# EAGLE design PCB_sch (EAGLE 9.6.2)
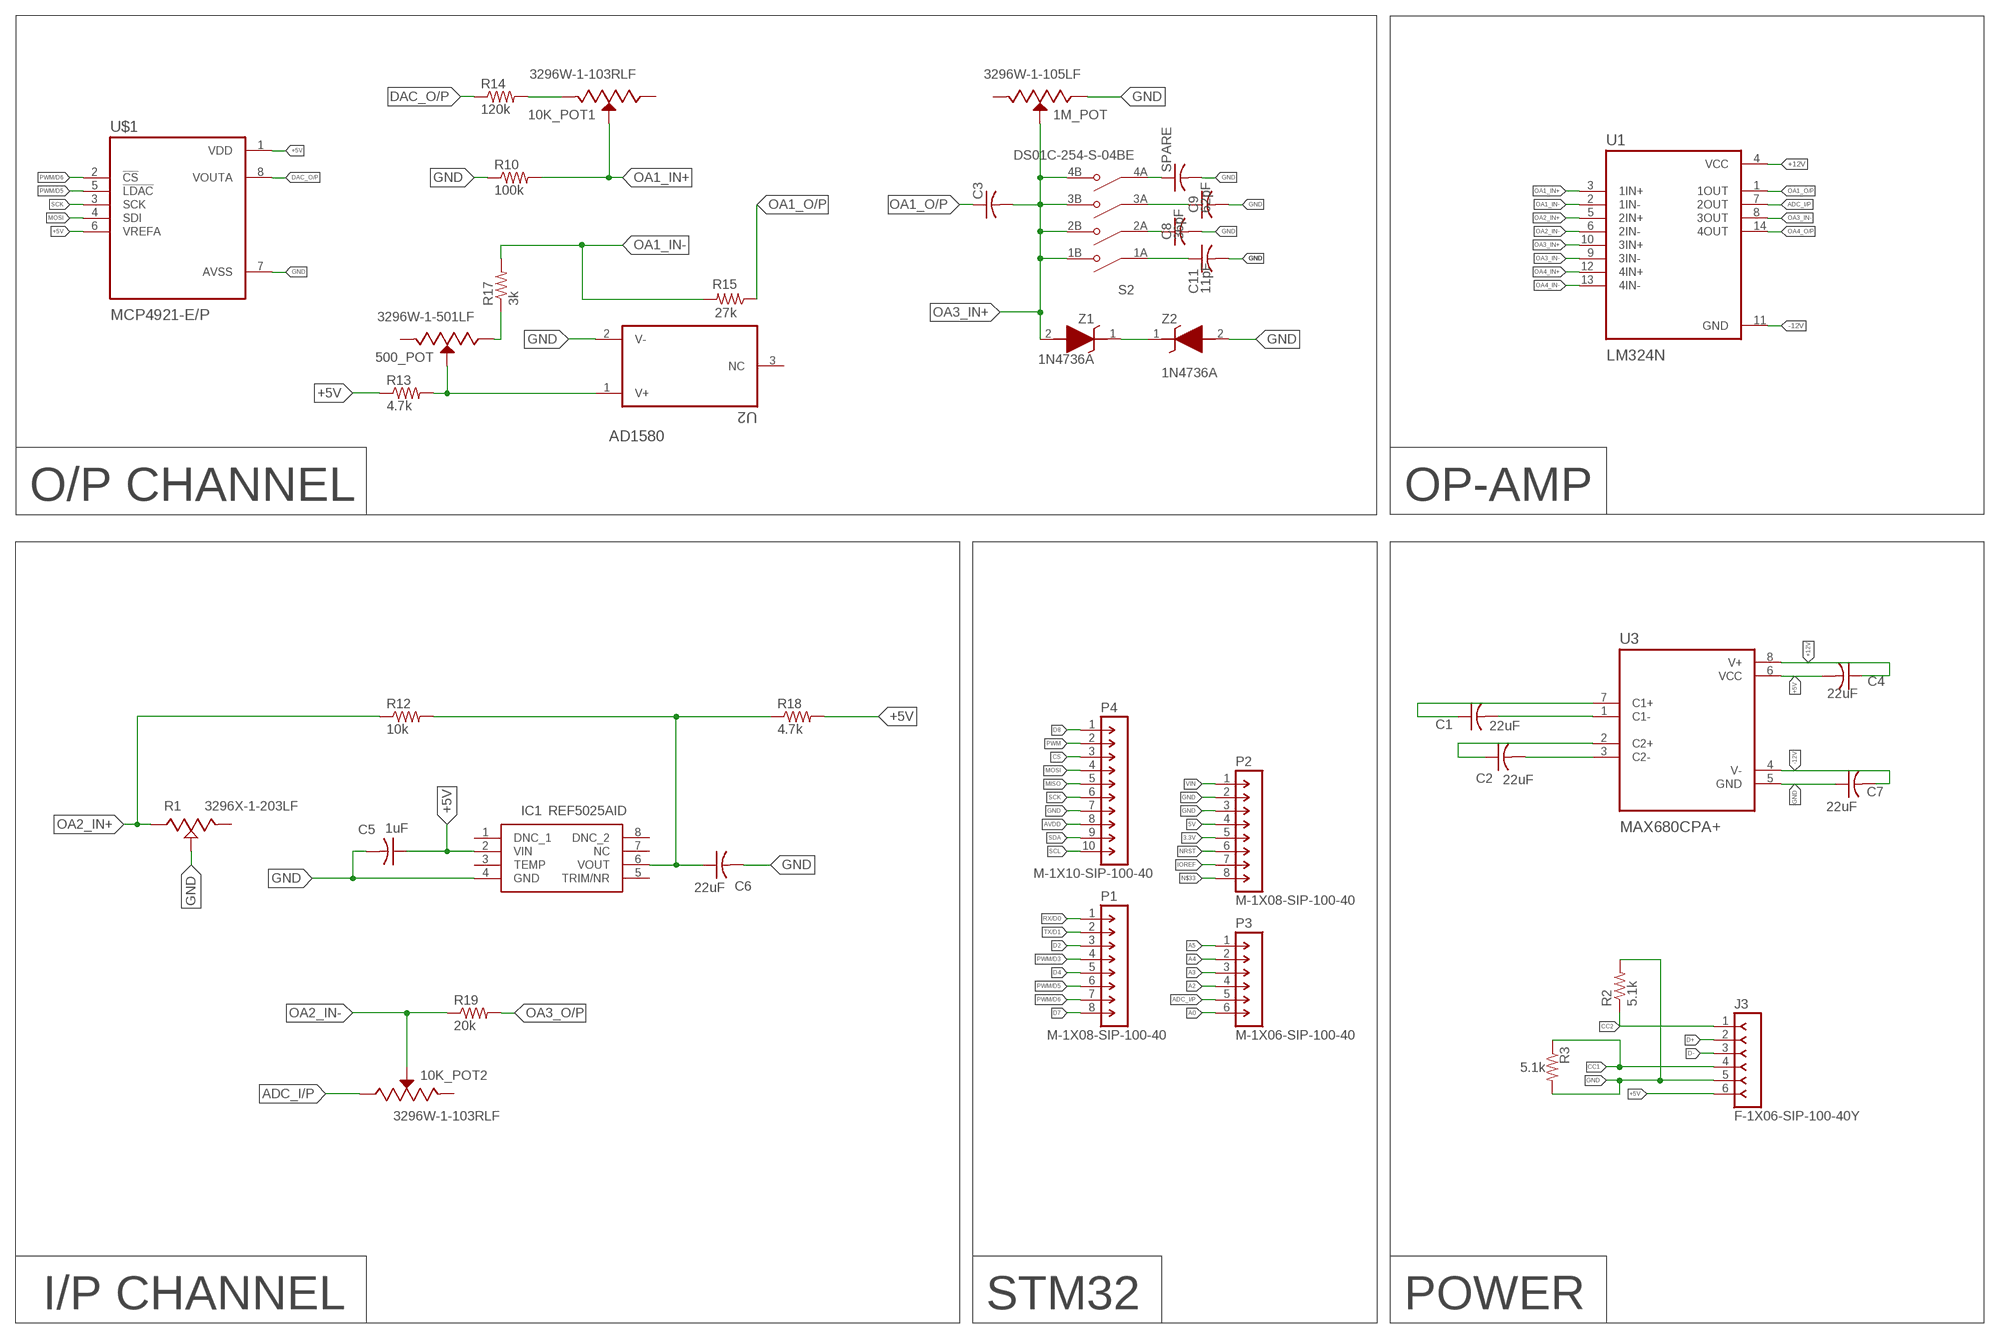
[diagram p0: schematic, sheet 1]

## Parts
1M_POT  3296W-1-105LF  [TRIM_3296W-1-105LF]
10K_POT1  3296W-1-103RLF  [TRIM_3296W-1-103RLF]
10K_POT2  3296W-1-103RLF  [TRIM_3296W-1-103RLF]
500_POT  3296W-1-501LF  [TRIM_3296W-1-501LF]
C1  22uF  C-USC0805  [C0805]
C2  22uF  C-USC0805  [C0805]
C3  C-US050-030X075  [C050-030X075]
C4  22uF  C-USC0805  [C0805]
C5  1uF  C-USC0805K  [C0805K]
C6  22uF  C-USC0805K  [C0805K]
C7  22uF  C-USC0805  [C0805]
C8  36pF  C-USC0805  [C0805]
C9  62pF  C-USC0805  [C0805]
C11  11pF  C-USC0805  [C0805]
IC1  REF5025AID  [SOIC127P600X175-8N]
J3  F-1X06-SIP-100-40Y  [SIP-100-06-40Y]
P1  M-1X08-SIP-100-40  [SIP-100-08-40]
P2  M-1X08-SIP-100-40  [SIP-100-08-40]
P3  M-1X06-SIP-100-40  [SIP-100-06-40]
P4  M-1X10-SIP-100-40  [SIP-100-10-40]
R1  3296X-1-203LF  [TRIM_3296X-1-203LF]
R2  5.1k  R-US_R0805  [R0805]
R3  5.1k  R-US_R0805  [R0805]
R10  100k  R-US_M0805  [M0805]
R12  10k  R-US_M0805  [M0805]
R13  4.7k  R-US_M0805  [M0805]
R14  120k  R-US_M0805  [M0805]
R15  27k  R-US_M0805  [M0805]
R17  3k  R-US_M0805  [M0805]
R18  4.7k  R-US_M0805  [M0805]
R19  20k  R-US_M0805  [M0805]
S2  DS01C-254-S-04BE  [SW_DS01C-254-S-04BE]
SPARE  C-USC0805  [C0805]
U1  LM324N  [DIP794W45P254L1969H508Q14]
U2  AD1580  AD1580BRTZ-R2-REEL7  [SOT96P237X112-3N]
U3  MAX680CPA+  [DIP794W47P254L991H457Q8]
U$1  MCP4921-E/P  [DIP787W46P254L927H533Q8]
Z1  1N4736A  [DIOAD1413W86L463D238]
Z2  1N4736A  [DIOAD1413W86L463D238]

## Nets
3.3V: P2.5
5V: P2.4
+5V: C4.2 C5.1 IC1.2(VIN) J3.6 R13.1 R18.2 U3.6(VCC) U$1.1(VDD) U$1.6(VREFA)
+12V: C4.1 U1.4(VCC) U3.8(V+)
-12V: C7.2 U1.11(GND) U3.4(V-)
A0: P3.6
A2: P3.4
A3: P3.3
A4: P3.2
A5: P3.1
ADC_I/P: 10K_POT2.1(CCW) P3.5 U1.7(2OUT)
AVDD: P4.8
CC1: J3.4 R3.1
CC2: J3.1 R2.1
CS: P4.3
D2: P1.3
D4: P1.5
D7: P1.8
D8: P4.1
D+: J3.2
D-: J3.3
DAC_O/P: R14.1 U$1.8(VOUTA)
GND: 1M_POT.1(CCW) C5.2 C6.2 C7.1 C8.2 C9.2 C11.2 IC1.4(GND) J3.5 P2.2 P2.3 P4.7 R1.2(WIPER) R2.2 R3.2 R10.1 SPARE.2 U2.2(V-) U3.5(GND) U$1.7(AVSS) Z2.2(A)
IOREF: P2.7
MISO: P4.5
MOSI: P4.4 U$1.4(SDI)
N$1: 10K_POT1.3(CW) R14.2
N$2: 10K_POT1.2(WIPER) R10.2
N$3: R15.2 R17.2
N$4: 500_POT.1(CCW) R17.1
N$5: C1.2 U3.1(C1-)
N$6: 500_POT.2(WIPER) R13.2 U2.1(V+)
N$7: C6.1 IC1.6(VOUT) R12.2 R18.1
N$8: Z1.1(K) Z2.1(K)
N$9: C1.1 U3.7(C1+)
N$10: C2.2 U3.3(C2-)
N$11: C2.1 U3.2(C2+)
N$12: C9.1 S2.3A(COM3)
N$13: S2.4A(COM4) SPARE.1
N$14: C11.1 S2.1A(COM1)
N$15: C8.1 S2.2A(COM2)
N$33: P2.8
NRST: P2.6
OA1_IN+: U1.3(1IN+)
OA1_IN-: U1.2(1IN-)
OA1_O/P: C3.1 R15.1 U1.1(1OUT)
OA2_IN+: R1.1(CCW) R12.1 U1.5(2IN+)
OA2_IN-: 10K_POT2.2(WIPER) R19.1 U1.6(2IN-)
OA3_IN+: 1M_POT.2(WIPER) C3.2 S2.1B(NO1) S2.2B(NO2) S2.3B(NO3) S2.4B(NO4) U1.10(3IN+) Z1.2(A)
OA3_IN-: U1.8(3OUT) U1.9(3IN-)
OA3_O/P: R19.2
OA4_IN+: U1.12(4IN+)
OA4_IN-: U1.13(4IN-)
OA4_O/P: U1.14(4OUT)
PWM: P4.2
PWM/D3: P1.4
PWM/D5: P1.6 U$1.5(!LDAC)
PWM/D6: P1.7 U$1.2(!CS)
RX/D0: P1.1
SCK: P4.6 U$1.3(SCK)
SCL: P4.10
SDA: P4.9
TX/D1: P1.2
VIN: P2.1
Unconnected: 1M_POT.3(CW) 10K_POT1.1(CCW) 10K_POT2.3(CW) 500_POT.3(CW) IC1.1(DNC_1) IC1.3(TEMP) IC1.5(TRIM/NR) IC1.7(NC) IC1.8(DNC_2) R1.3(CW) U2.3(NC)

## Notes on the sheet
- O/P CHANNEL | OP-AMP
- I/P CHANNEL | STM32 | POWER

## Library data of the parts
1M_POT = 3296W-1-105LF:3296W-1-105LF: Res Cermet Trimmer 500K Ohm 10% 0.5W 25(Elec)Turn 2.19mm (9.53 X 4.83 X 11.55mm) Pin Thru-Hole Tube Check availability <https://pricing.snapeda.com/parts/3296W-1-105LF/Bourns/view-part?ref=eda>; AVAILABILITY: In Stock; CHECK_PRICES: https://www.snapeda.com/parts/3296W-1-105LF/Bourns/view-part/?ref=eda; DESCRIPTION: Trimmer, Cermet, Rest 1 Megohms, PCB, 25 Turns, Pwr-Rtg 0.5W | Bourns 3296W-1-105LF; MF: Bourns; MP: 3296W-1-105LF; PACKAGE: NON STANDARD-3 Bourns; PRICE: None; SNAPEDA_LINK: https://www.snapeda.com/parts/3296W-1-105LF/Bourns/view-part/?ref=snap
10K_POT1 10K_POT2 = 3296W-1-103RLF:3296W-1-103RLF: Res Cermet Trimmer 500K Ohm 10% 0.5W 25(Elec)Turn 2.19mm (9.53 X 4.83 X 11.55mm) Pin Thru-Hole Tube Check availability <https://pricing.snapeda.com/parts/3296W-1-103RLF/Bourns/view-part?ref=eda>; AVAILABILITY: In Stock; CHECK_PRICES: https://www.snapeda.com/parts/3296W-1-103RLF/Bourns/view-part/?ref=eda; DESCRIPTION: Trimmer, Cermet, Rest 10 Kilohms, PCB, 25 Turns, Pwr-Rtg 0.5W | Bourns 3296W-1-103RLF; MF: Bourns; MP: 3296W-1-103RLF; PACKAGE: NON STANDARD-3 Bourns; PRICE: None; PURCHASE-URL: https://www.snapeda.com/api/url_track_click_mouser/?unipart_id=480309&manufacturer=Bourns&part_name=3296W-1-103RLF&search_term=None; SNAPEDA_LINK: https://www.snapeda.com/parts/3296W-1-103RLF/Bourns/view-part/?ref=snap
500_POT = 3296W-1-501LF:3296W-1-501LF: Res Cermet Trimmer 500K Ohm 10% 0.5W 25(Elec)Turn 2.19mm (9.53 X 4.83 X 11.55mm) Pin Thru-Hole Tube Check availability <https://pricing.snapeda.com/parts/3296W-1-501LF/Bourns/view-part?ref=eda>; AVAILABILITY: In Stock; CHECK_PRICES: https://www.snapeda.com/parts/3296W-1-501LF/Bourns/view-part/?ref=eda; DESCRIPTION: Trimmer, Cermet, Rest 500 Ohms, PCB, 25 Turns, Pwr-Rtg 0.5W | Bourns 3296W-1-501LF; MF: Bourns; MP: 3296W-1-501LF; PACKAGE: NON STANDARD-3 Bourns; PRICE: None; SNAPEDA_LINK: https://www.snapeda.com/parts/3296W-1-501LF/Bourns/view-part/?ref=snap
C1-C9 SPARE = adafruit:C-US: CAPACITOR, American symbol
C11 = adafruit:C-US: CAPACITOR, American symbol; SPICEPREFIX: C
IC1 = REF5025AID:REF5025AID: 3 Vpp/V Noise, 3 ppm/C Drift Precision Series Voltage Reference Source: Datasheet <http://www.ti.com/lit/ds/symlink/ref5025.pdf>; DESCRIPTION: 3 Vpp/V Noise, 3 ppm/C Drift Precision Series Voltage Reference; HEIGHT: 1.75mm; MANUFACTURER_NAME: Texas Instruments; MANUFACTURER_PART_NUMBER: REF5025AID; MOUSER_PART_NUMBER: 595-REF5025AID; MOUSER_PRICE-STOCK: https://www.mouser.co.uk/ProductDetail/Texas-Instruments/REF5025AID?qs=xL7PkI2RoJ6OzMm6G7%2FePw%3D%3D
J3 = con-headers-jp:F-1X06-: FEMALE HEADER
P1 P2 = con-headers-jp:M-1X08-: MALE HEADER
P3 = con-headers-jp:M-1X06-: MALE HEADER
P4 = con-headers-jp:M-1X10-: MALE HEADER
R1 = 3296X-1-203LF:3296X-1-203LF: Res Cermet Trimmer 20K Ohm 10% 1/2W 25(Elec)Turn 2.19mm (11.05 X 4.83 X 10.03mm) Pin Thru-Hole Tube Check availability <https://pricing.snapeda.com/parts/3296X-1-203LF/Bourns/view-part?ref=eda>; AVAILABILITY: In Stock; CHECK_PRICES: https://www.snapeda.com/parts/3296X-1-203LF/Bourns/view-part/?ref=eda; DESCRIPTION: Trimmer, Cermet, Rest 20 Kilohms, PCB, 25 Turns, Pwr-Rtg 0.5W | Bourns 3296X-1-203LF; MF: Bourns; MP: 3296X-1-203LF; PACKAGE: SOD-123 Bourns; PRICE: None; PURCHASE-URL: https://www.snapeda.com/api/url_track_click_mouser/?unipart_id=270465&manufacturer=Bourns&part_name=3296X-1-203LF&search_term=None; SNAPEDA_LINK: https://www.snapeda.com/parts/3296X-1-203LF/Bourns/view-part/?ref=snap
R2 R3 R10 R12-R15 R17-R19 = adafruit:R-US_: RESISTOR, American symbol
S2 = DS01C-254-S-04BE:DS01C-254-S-04BE; MANUFACTURER: CUI; MAXIMUM_PACKAGE_HEIGHT: 7.0mm; PARTREV: 1.0; STANDARD: Manufacturer recommendations
U1 = LM324N:LM324N: Check availability <https://pricing.snapeda.com/parts/LM324N/STMicroelectronics/view-part?ref=eda>; AVAILABILITY: In Stock; CHECK_PRICES: https://www.snapeda.com/parts/LM324N/STMicroelectronics/view-part/?ref=eda; DESCRIPTION: Operational amplifier; 3÷32VDC; Channels: 4; DIP14; MF: STMicroelectronics; MP: LM324N; PACKAGE: DIP-14 Motorola; PRICE: None; PURCHASE-URL: https://www.snapeda.com/api/url_track_click_mouser/?unipart_id=18365&manufacturer=STMicroelectronics&part_name=LM324N&search_term=None; SNAPEDA_LINK: https://www.snapeda.com/parts/LM324N/STMicroelectronics/view-part/?ref=snap
U2 = AD1580BRTZ-R2-REEL7:AD1580BRTZ-R2-REEL7
U3 = MAX680CPA_:MAX680CPA+: None Check availability <https://pricing.snapeda.com/parts/MAX680CPA%2B/Maxim%20Integrated%20Products/view-part?ref=eda>; AVAILABILITY: In Stock; CHECK_PRICES: https://www.snapeda.com/parts/MAX680CPA+/Analog+Devices/view-part/?ref=eda; DESCRIPTION: Charge Pump Switching Regulator IC Positive and Negative (Dual Rail) Fixed ±2Vin 2 Output 10mA 8-DIP (0.300, 7.62mm); MF: Maxim Integrated Products; MP: MAX680CPA+; PACKAGE: None; PRICE: None; SNAPEDA_LINK: https://www.snapeda.com/parts/MAX680CPA+/Analog+Devices/view-part/?ref=snap
U$1 = MCP4921-E_P:MCP4921-E/P; CHECK_PRICES: https://www.snapeda.com/parts/MCP4921-E/P/Microchip/view-part/?ref=eda; DESCRIPTION: Microchip 12 bit Serial DAC 8-Pin PDIP | Microchip Technology Inc. MCP4921-E/P; MF: Microchip; MP: MCP4921-E/P; PACKAGE: DIP-8 Microchip; PURCHASE-URL: https://www.snapeda.com/api/url_track_click_mouser/?unipart_id=60&manufacturer=Microchip&part_name=MCP4921-E/P&search_term=mcp4921; SNAPEDA_LINK: https://www.snapeda.com/parts/MCP4921-E/P/Microchip/view-part/?ref=snap
Z1 Z2 = 1N4736A:1N4736A: 1N4736 - Zener Diode, 6.8V, 5%, 1W Source: Datasheet <https://www.onsemi.com/pdf/datasheet/1n4736at-d.pdf>; DESCRIPTION: 1N4736 - Zener Diode, 6.8V, 5%, 1W; HEIGHT: mm; MANUFACTURER_NAME: onsemi; MANUFACTURER_PART_NUMBER: 1N4736A; MOUSER_PART_NUMBER: 512-1N4736A; MOUSER_PRICE-STOCK: https://www.mouser.co.uk/ProductDetail/onsemi-Fairchild/1N4736A?qs=SSucg2PyLi6CNqBOqJ%2FVZw%3D%3D

## Board
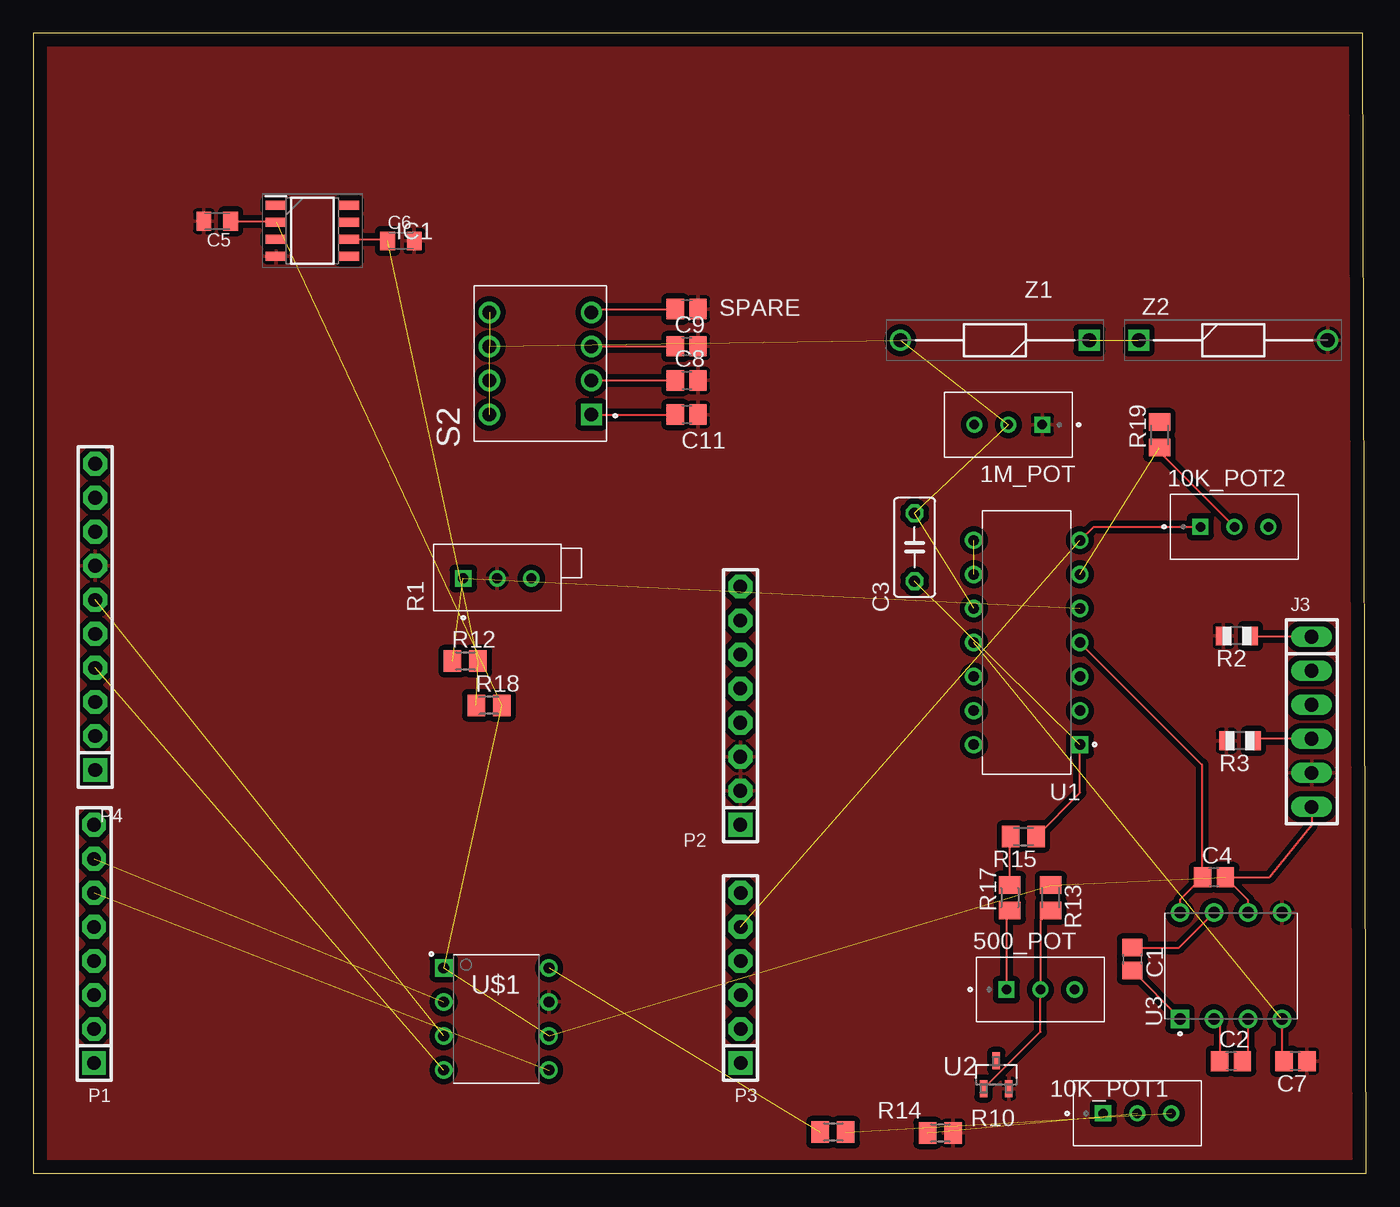
[diagram p1: board, top side]
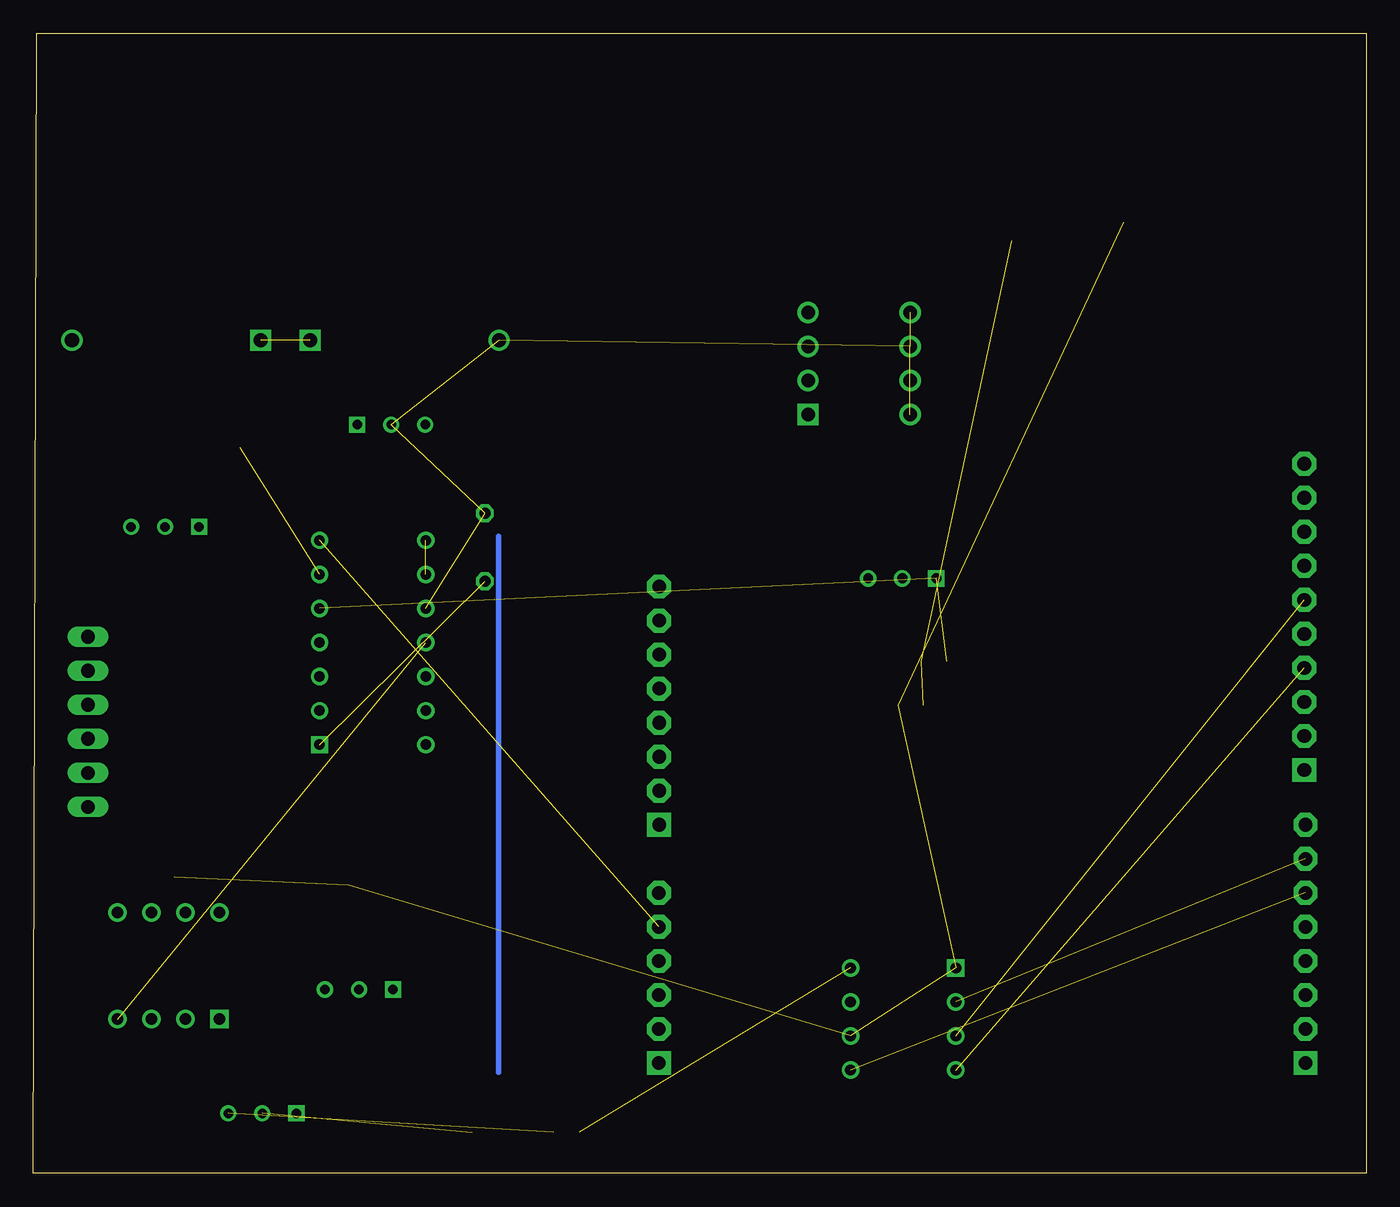
[diagram p2: board, bottom side, seen from below]

Size 99.49 x 85.08 mm. Coordinates in mm from the lower left corner, seen from the top.
Outline: 0,0 99.49,0 99.24,85.08 0,85.08 0,0
Copper layers (1*16): Top 0.035mm / dielectric 1.5mm / Bottom 0.035mm
Design rules "default *": minimum track width 6mil, minimum drill 0.35mm, track to track 16mil, track to pad 16mil, pad to pad 16mil, via to via 16mil, smd to smd 16mil, copper to edge 40mil, drill to drill 6mil, minimum pad ring 10mil, minimum via ring 8mil, stop-mask expansion 4mil, vias tented up to drill 0mil, thermal gap 10mil

### Footprints (pad centres in the part's own frame; a part is rotated, then mirrored left to right if it is on the bottom)
TRIM_3296W-1-105LF = drill 0.71 square: 1 -2.54,0 | drill 0.71: 2 0,0; 3 2.54,0
TRIM_3296W-1-103RLF = drill 0.71 square: 1 -2.54,0 | drill 0.71: 2 0,0; 3 2.54,0
TRIM_3296W-1-501LF = drill 0.71 square: 1 -2.54,0 | drill 0.71: 2 0,0; 3 2.54,0
C0805 = smd 1.3 x 1.5: 1 -0.85,0; 2 0.85,0
C050-030X075 = drill 0.813 octagon: 1 -2.54,0; 2 2.54,0
C0805K = smd 1.1 x 1.4: 1 -1,0; 2 1,0
SOIC127P600X175-8N = smd 1.528 x 0.65: 1 -2.711,1.905; 2 -2.711,0.635; 3 -2.711,-0.635; 4 -2.711,-1.905; 5 2.711,-1.905; 6 2.711,-0.635; 7 2.711,0.635; 8 2.711,1.905
SIP-100-06-40Y = drill 1.016 long: 1 -6.35,0; 2 -3.81,0; 3 -1.27,0; 4 1.27,0; 5 3.81,0; 6 6.35,0
SIP-100-08-40 = drill 1.016 pad 1.778 square: 1 -8.89,0 | drill 1.016 pad 1.778 octagon: 2 -6.35,0; 3 -3.81,0; 4 -1.27,0; 5 1.27,0; 6 3.81,0; 7 6.35,0; 8 8.89,0
SIP-100-06-40 = drill 1.016 pad 1.778 square: 1 -6.35,0 | drill 1.016 pad 1.778 octagon: 2 -3.81,0; 3 -1.27,0; 4 1.27,0; 5 3.81,0; 6 6.35,0
SIP-100-10-40 = drill 1.016 pad 1.778 square: 1 -11.43,0 | drill 1.016 pad 1.778 octagon: 2 -8.89,0; 3 -6.35,0; 4 -3.81,0; 5 -1.27,0; 6 1.27,0; 7 3.81,0; 8 6.35,0; 9 8.89,0; 10 11.43,0
TRIM_3296X-1-203LF = drill 0.74 pad 1.14 square: 1 0,2.54 | drill 0.74 pad 1.14: 2 0,0; 3 0,-2.54
R0805 = smd 1.1 x 1.4: 1 -1,0; 2 1,0
M0805 = smd 1.3 x 1.6: 1 -0.95,0; 2 0.95,0
SW_DS01C-254-S-04BE = drill 1 pad 1.58 square: 1A -3.81,-3.81 | drill 1 pad 1.58: 1B -3.81,3.81; 2A -1.27,-3.81; 2B -1.27,3.81; 3A 1.27,-3.81; 3B 1.27,3.81; 4A 3.81,-3.81; 4B 3.81,3.81
DIP794W45P254L1969H508Q14 = drill 0.77 pad 1.17 square: 1 -3.97,7.62 | drill 0.77 pad 1.17: 2 -3.97,5.08; 3 -3.97,2.54; 4 -3.97,0; 5 -3.97,-2.54; 6 -3.97,-5.08; 7 -3.97,-7.62; 8 3.97,-7.62; 9 3.97,-5.08; 10 3.97,-2.54; 11 3.97,0; 12 3.97,2.54; 13 3.97,5.08; 14 3.97,7.62
SOT96P237X112-3N = smd 0.559 x 1.27: 1 -0.94,-1.041; 2 0.94,-1.041; 3 0,1.041
DIP794W47P254L991H457Q8 = drill 0.86 pad 1.21 square: 1 -3.97,3.81 | drill 0.86 pad 1.21: 2 -3.97,1.27; 3 -3.97,-1.27; 4 -3.97,-3.81; 5 3.97,-3.81; 6 3.97,-1.27; 7 3.97,1.27; 8 3.97,3.81
DIP787W46P254L927H533Q8 = drill 0.8 square: 1 -3.935,3.81 | drill 0.8: 2 -3.935,1.27; 3 -3.935,-1.27; 4 -3.935,-3.81; 5 3.935,-3.81; 6 3.935,-1.27; 7 3.935,1.27; 8 3.935,3.81
DIOAD1413W86L463D238 = drill 1.05 pad 1.575 square: 1 0,0 | drill 1.05 pad 1.575: 2 14.1,0

### Placement (x,y rotation side)
1M_POT  72.79,55.88 180 top
10K_POT1  82.41,4.48 0 top
10K_POT2  89.66,48.26 0 top
500_POT  75.18,13.72 0 top
C1  82.04,16 270 top
C2  89.41,8.38 0 top
C3  65.79,46.74 90 top
C4  88.14,22.1 0 top
C5  13.72,71.06 180 top
C6  27.43,69.6 0 top
C7  94.23,8.38 180 top
C8  48.77,59.18 0 top
C9  48.77,61.72 0 top
C11  48.77,56.64 0 top
IC1  20.83,70.36 0 top
J3  95.43,33.71 270 top
P1  4.52,17.13 90 top
P2  52.78,34.91 90 top
P3  52.79,14.59 90 top
P4  4.61,41.54 90 top
R1  34.63,44.41 90 top
R2  89.84,40.12 180 top
R3  90.07,32.3 180 top
R10  67.7,3.02 180 top
R12  32.23,38.23 0 top
R13  75.95,20.57 270 top
R14  59.7,3.08 0 top
R15  73.91,25.15 180 top
R17  72.9,20.57 90 top
R18  34.01,34.93 0 top
R19  84.07,55.12 90 top
S2  37.85,60.45 90 top
SPARE  48.77,64.52 0 top
U1  74.17,39.62 180 top
U2  71.88,7.37 0 top
U3  89.41,15.49 90 top
U$1  34.56,11.53 0 top
Z1  78.84,62.18 180 top
Z2  82.52,62.18 0 top

### Tracks (layer width: path | path; a pad name or v marks a point on that pad's centre or on a via)
+5V  (5 unrouted)
  Top 0.152: U3.6 90.68,20.41 C4.2 92.27,22.1 95.43,26.01 J3.6 | C5.1 18.05,71.06 IC1.2
+12V
  Top 0.152: C4.1 87.25,22.06 | 87.25,22.06 85.6,20.41 U3.8 | U1.4 87.25,30.52 87.25,22.06
-12V  (1 unrouted)
  Top 0.152: U3.4 93.22,8.55 C7.2
ADC_I/P  (1 unrouted)
  Top 0.152: U1.7 79.15,48.26 10K_POT2.1
CC1
  Top 0.152: J3.4 91.21,32.44 R3.1
CC2
  Top 0.152: J3.1 90.9,40.06 R2.1
DAC_O/P  (1 unrouted)
GND
  pour Top: 100.76,86.54 100.76,-1.46 -2.24,-1.46 -2.24,86.54
MOSI  (1 unrouted)
N$1  (1 unrouted)
N$2  (1 unrouted)
N$3
  Top 0.152: R17.2 72.9,25.08 R15.2
N$4
  Top 0.152: R17.1 72.64,19.37 500_POT.1
N$5
  Top 0.152: C1.2 85.6,11.6 U3.1
N$6
  Top 0.152: R13.2 75.18,18.86 500_POT.2 75.18,10.57 U2.1
N$7  (2 unrouted)
  Top 0.152: IC1.6 26.3,69.72 C6.1
N$8  (1 unrouted)
N$9
  Top 0.152: C1.1 85.53,16.85 U3.7
N$10
  Top 0.152: U3.3 90.68,8.8 C2.2
N$11
  Top 0.152: U3.2 88.56,11.1 C2.1
N$12
  Top 0.152: S2.3A C9.1
N$13
  Top 0.152: S2.4A 41.91,64.52 SPARE.1
N$14
  Top 0.152: S2.1A C11.1
N$15
  Top 0.152: S2.2A C8.1
N$16
  Bottom 0.406: 64.76,7.54 64.76,47.54
OA1_O/P  (1 unrouted)
  Top 0.152: R15.1 78.14,28.42 U1.1
OA2_IN+  (2 unrouted)
OA2_IN-  (1 unrouted)
  Top 0.152: 10K_POT2.2 84.07,53.85 R19.1
OA3_IN+  (7 unrouted)
OA3_IN-  (1 unrouted)
PWM/D5  (1 unrouted)
PWM/D6  (1 unrouted)
SCK  (1 unrouted)
(copper drawn outside any net)
  shapes: Top area x2